# Altium schematic sheet Schematic.SchDoc
size B; SheetNumber: 1; SheetTotal: 1
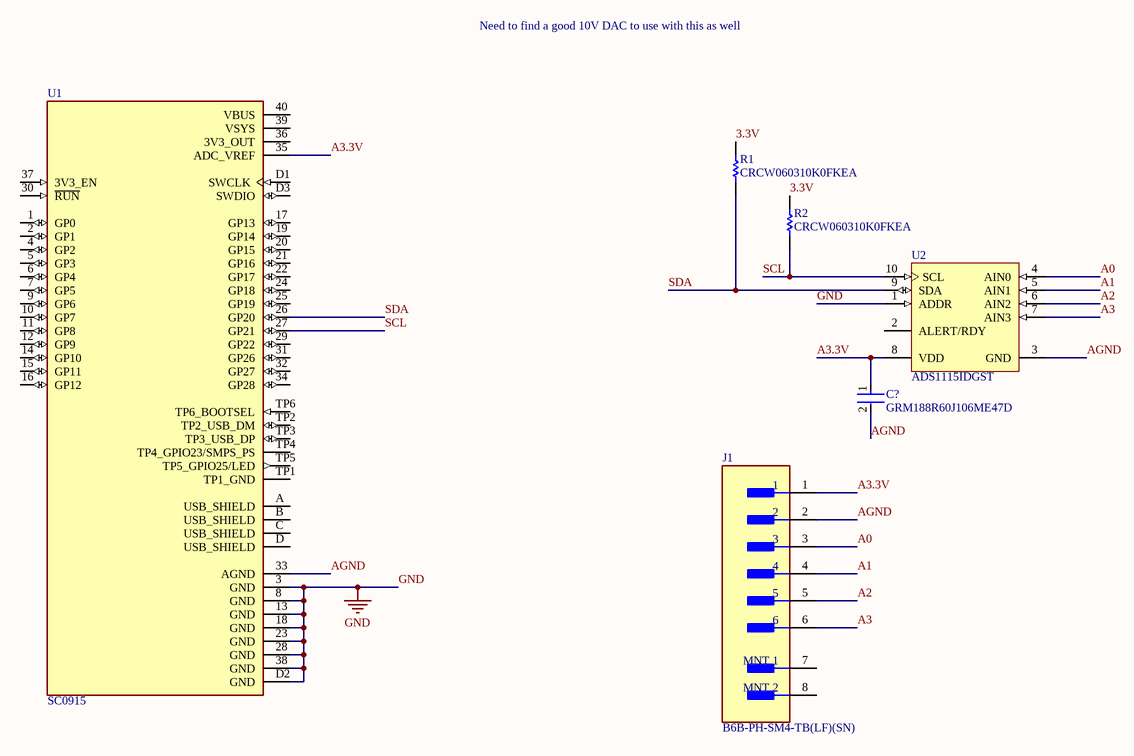
[diagram p0: Schematic.SchDoc]

## Parts
C?  GRM188R60J106ME47D  [FP-GRM188-0_1-e0_2_0_55-IPC_A]
J1  B6B-PH-SM4-TB(LF)(SN)  [FP-B6B-PH-SM4-TB_LF_SN-MFG]
R1  CRCW060310K0FKEA  [RESC1609X50X30NL8T20]
R2  CRCW060310K0FKEA  [RESC1609X50X30NL8T20]
U1  SC0915  [MODULE_SC0915]
U2  ADS1115IDGST  [TI-DGS10_M]

## Nets
GND: U1.3(GND) U1.8(GND) U1.13(GND) U1.18(GND) U1.23(GND) U1.28(GND) U1.38(GND) U1.D2(GND) U2.1(ADDR)
3.3V: R1.2 R2.2
A0: J1.3 U2.4(AIN0)
A1: J1.4 U2.5(AIN1)
A2: J1.5 U2.6(AIN2)
A3: J1.6 U2.7(AIN3)
A3.3V: C?.1 J1.1 U1.35(ADC_VREF) U2.8(VDD)
AGND: C?.2 J1.2 U1.33(AGND) U2.3(GND)
SCL: R2.1 U1.27(GP21) U2.10(SCL)
SDA: R1.1 U1.26(GP20) U2.9(SDA)

Not connected (* = marked no-connect by the designer): J1 7(MNT_1) 8(MNT_2); U1 1(GP0) 2(GP1) 4(GP2) 5(GP3) 6(GP4) 7(GP5) 9(GP6) 10(GP7) 11(GP8) 12(GP9) 14(GP10) 15(GP11) 16(GP12) 17(GP13) 19(GP14) 20(GP15) 21(GP16) 22(GP17) 24(GP18) 25(GP19) 29(GP22) 30(~{RUN}) 31(GP26) 32(GP27) 34(GP28) 36(3V3_OUT) 37(3V3_EN) 39(VSYS) 40(VBUS) A(USB_SHIELD) B(USB_SHIELD) C(USB_SHIELD) D(USB_SHIELD) D1(SWCLK) D3(SWDIO) TP1(TP1_GND) TP2(TP2_USB_DM) TP3(TP3_USB_DP) TP4(TP4_GPIO23/SMPS_PS) TP5(TP5_GPIO25/LED) TP6(TP6_BOOTSEL); U2 2(ALERT/RDY)

## Notes on the sheet
- Need to find a good 10V DAC to use with this as well

## Library data of the parts
C? = CMP-2006-02792-2: Chip Multilayer Ceramic Capacitors for General Purpose, 0603, 10uF, X5R, 15%, 20%, 6.3V; Packaging: Tape and Reel; Voltage Rating (DC): 6.3V; Width: 0.031inch; Termination: SMD/SMT; Dielectric: X5R; Package Quantity: 4000; Voltage Rating: 6.3V; Capacitance: 10uF; Case/Package: 0603; Min Operating Temperature: -55°C; Voltage: 6.3V; Length: 1.6mm; Thickness: 0.035inch; Lead Free: Lead Free; Depth: 0.8mm; Case Code (Imperial): 0603; Max Operating Temperature: 85°C; Material: Ceramic; Height: 0.8mm; Tolerance: 20%; Mount: Surface Mount; REACH SVHC: No SVHC; Radiation Hardening: No; Case Code (Metric): 1608
J1 = CMP-17439-000051-1: CONN HEADER SMD 6POS 2MM; Number of Positions: 6; Working Voltage: 100V; Contact Resistance: 10mR; Insulation Resistance: 1GR; Current Rating: 2A; Mated Stacking Heights: 8.6mm; Gender: Male; Max Operating Temperature: 85°C; Contact Finish - Mating: TIN; Min Operating Temperature: -25°C; Height: 9.4mm; Contact Plating: Tin; Number of Poles: 6; Series: PH; Number of Rows: 1; Termination: Solder; Packaging: Tape and Reel; Contact Mating Length: 0.13inch; Voltage Rating (AC): 100V; Insulation Height: 0.26inch; Mount: Surface Mount; Contact Material: Copper Alloy; Length: 13.9mm; Contact Shape: Square; Flammability Rating: UL94 V-0; Voltage Rating: 100V; Contact Type: Male Pin; Connector Type: Header; Lead Pitch: 2mm; Housing Color: Natural; Color: Natural; Insulation Material: Nylon; Insulation Color: Natural; REACH SVHC: No SVHC; Housing Material: Nylon; Pitch: 2mm; Fastening Type: Detent; Orientation: Straight; Lead Free: Lead Free; Width: 5.5mm; Number of Contacts: 6
R1 R2 = CMP-1666-00005-4: Chip Resistor, 10 KOhm, +/- 1%, 100 mW, -55 to 155 degC, 0603 (1608 Metric), RoHS, Tape and Reel; Manufacturer: Vishay Semiconductor; Voltage Rating: 75 V; Max Operating Temperature: 155 degC; PackageDescription: 2-Pin Surface Mount Device, Body 1.575 x 0.85 mm; ComponentLink1Description: Manufacturer URL; RoHSCompliant: true; PackageReference: 0603; REACH SVHC: Unknown; Length: 1.55 mm; DatasheetVersion: 06/2012; Packaging: Tape and Reel; Min Operating Temperature: -55 degC; Mounting Technology: Surface Mount; ComponentLink2URL: https://datasheet.ciiva.com/11809/0900766b80d98afc-11809037.pdf; Height: 0.45 mm; ComponentLink2Description: Datasheet; Package Quantity: 5000; ComponentLink1URL: http://www.vishay.com/
U1 = SC0915: RP2040 Raspberry Pi Pico series ARMÂ® CortexÂ®-M0+ MCU 32-Bit Embedded Evaluation Board; SnapEDA_Link: https://www.snapeda.com/parts/SC0915/Raspberry+Pi/view-part/?ref=snap; Availability: In Stock; Package: None; Price: None; MP: SC0915; Check_prices: https://www.snapeda.com/parts/SC0915/Raspberry+Pi/view-part/?ref=eda; MF: Raspberry Pi; Value: *; Purchase-URL: https://pricing.snapeda.com/search/part/SC0915/?ref=eda
U2 = CMP-0003-00378-2: 16-Bit ADC with Integrated Multiplexer, PGA, Comparator, Oscillator, and Reference, -40 to 125 degC, 10-pin SOP (DGS10), Green (RoHS & no Sb/Br); Manufacturer: Texas Instruments; Sample Rate (max)(SPS): 860; SubFamily: Precision ADC (<=10MSPS); Architecture: Delta-Sigma; Digital Supply(Min)(V): 2; Resolution(Bits): 16; Digital Supply(Max)(V): 5.5; INL(Max)(+/-LSB): 1; Interface: Serial I2C; # Input Channels: 4; Eco-Plan: Green (RoHS & no Sb/Br); PackageDescription: 10-Pin Plastic Small Outline, Body 3 x 3 mm, Pitch 0.5 mm; Mounting Technology: Surface Mount; PackageReference: DGS10; DatasheetVersion: SBAS444B; ComponentLink3Description: Package Specification; ComponentLink1Description: Manufacturer URL; PartNumber: ADS1115IDGST; ComponentLink3URL: http://www.ti.com/lit/ml/mpds035b/mpds035b.pdf; ComponentLink2URL: http://www.ti.com/general/docs/lit/getliterature.tsp?genericPartNumber=ADS1115&fileType=pdf; Analog Voltage AV/DD(Min)(V): 2; ComponentLink2Description: Datasheet; PackageVersion: 4073272/C, 02/2004; Analog Voltage AV/DD(Max)(V): 5.5; Code_JEDEC: MO-153; ComponentLink1URL: http://www.ti.com/